# Altium schematic sheet MSXIV_ConnectorTestingBoard.SchDoc: Connector Testing Board
size Letter; Author: Ricky Huang; Website: www.uwmidsun.com
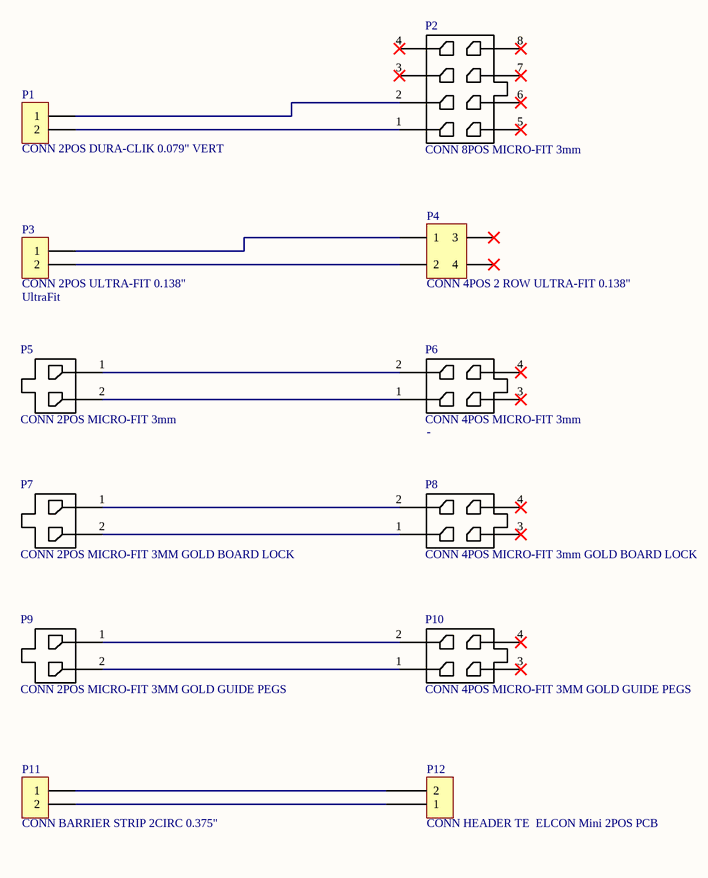
[diagram p0: MSXIV_ConnectorTestingBoard.SchDoc]

## Parts
P1  CONN 2POS DURA-CLIK 0.079" VERT  [CONN, 2POS Dura-Click Vertical]
P2  CONN 8POS MICRO-FIT 3mm  [CONN, 8POS MICRO-FIT]
P3  CONN 2POS ULTRA-FIT 0.138"  Series: UltraFit  [CONN, 2POS ULTRA-FIT]
P4  CONN 4POS 2 ROW ULTRA-FIT 0.138"  [CONN, 4POS 2 ROW ULTRA-FIT]
P5  CONN 2POS MICRO-FIT 3mm  [CONN 2POS MICRO-FIT 3mm-Footprint-1]
P6  CONN 4POS MICRO-FIT 3mm  [CONN 4POS MICROFIT (2x2)]
P7  CONN 2POS MICRO-FIT 3MM GOLD BOARD LOCK  [CONN HEADER VERT 2POS 3MM GOLD BOARD LOCK-Footprint-1]
P8  CONN 4POS MICRO-FIT 3mm GOLD BOARD LOCK  [CONN 4POS MICRO-FIT 3mm GOLD BOARD LOCK-Footprint-1]
P9  CONN 2POS MICRO-FIT 3MM GOLD GUIDE PEGS  [CONN 2POS MICRO-FIT 3MM GOLD GUIDE PEGS-Footprint-1]
P10  CONN 4POS MICRO-FIT 3MM GOLD GUIDE PEGS  [CONN 4POS MICRO-FIT 3MM GOLD GUIDE PEGS-Footprint-1]
P11  CONN BARRIER STRIP 2CIRC 0.375"  [TE_3-1437652-9]
P12  CONN HEADER TE  ELCON Mini 2POS PCB  [CONN HEADER TE  ELCON Mini 2POS PCB-Footprint-1]

## Nets
NetP1_1: P1.1 P2.2
NetP1_2: P1.2 P2.1
NetP3_1: P3.1 P4.1
NetP3_2: P3.2 P4.2
NetP5_1: P5.1 P6.2
NetP5_2: P5.2 P6.1
NetP7_1: P7.1 P8.2
NetP7_2: P7.2 P8.1
NetP9_1: P9.1 P10.2
NetP9_2: P9.2 P10.1
NetP11_1: P11.1 P12.2
NetP11_2: P11.2 P12.1

Not connected (* = marked no-connect by the designer): P2 3* 4* 5* 6* 7* 8*; P4 3* 4*; P6 3* 4*; P8 3* 4*; P10 3* 4*

## Notes on the sheet
- Project:
- Title:
- Size:
- Project Author
- Letter
- Revision:
- University of Waterloo
- 200 University Ave W
- Waterloo, ON, Canada
- N2L 3E9
- Date:
- Sheet
- of
- Website:

## Library data of the parts
P1 = CMP-007-0025-1: 2 Positions Header, Shrouded Connector 0.079" (2.00mm) Surface Mount, Vertical Tin; Manufacturer: Molex, LLC; Manufacturer Part Number: 5600200220; Number of Positions: 2; Shrouding: Shrouded - 4 Wall; Mated Stacking Heights: 9.3mm; Number of Positions Loaded: All; Style: Board to Cable/Wire; Overall Contact Length: -; Contact Length - Post: -; Contact Shape: Square; Material Flammability Rating: -; Stock 1: 11912; Row Spacing - Mating: -; Number of Rows: 1; Insulation Height: 0.315" (8.00mm); Operating Temperature: -; Part Status: Active; Pitch - Mating: 0.079" (2.00mm); Insulation Material: Polyamide (PA), Nylon; ComponentLink1URL: http://www.molex.com/pdm_docs/sd/5600200220_sd.pdf; Contact Length - Mating: -; Ingress Protection: -; ComponentLink1Description: http://www.molex.com/pdm_docs/sd/5600200220_sd.pdf; Contact Finish - Mating: Tin; Design Item ID: CONN 2POS DURA-CLIK 0.079" VERT; Insulation Color: Natural; Current Rating: -; Packaging: Cut Tape (CT); Pricing 1: 1=1.16, 10=1.012, 25=0.952, 50=0.9122, 100=0.8727, 250=0.79336 (CAD); Connector Type: Header; Fastening Type: Latch Lock; Contact Finish Thickness - Mating: -; Termination: Solder; Features: Solder Retention; Contact Material: Copper Alloy; Contact Finish - Post: Tin; Contact Type: Male Pin; Voltage Rating: -; Contact Finish Thickness - Post: -; Source: Schematic Diagrams.SchLib; Applications: Automotive, Industrial; RoHS: RoHS Compliant; Mounting Type: Surface Mount
P2 = CMP-007-0004-1: Connector Header Through Hole 6 position 0.118" (3.00mm); Manufacturer Part Number: 0430450827; Manufacturer: Molex, LLC; Style: Board to Cable/Wire; Material Flammability Rating: UL94 V-0; Number of Positions Loaded: All; Shrouding: Shrouded - 4 Wall; Contact Length - Post: 0.125" (3.18mm); Number of Positions: 6; Mounting Type: Through Hole; ComponentLink2Description: https://www.molex.com/pdm_docs/sd/430450827_sd.pdf; Source: Schematic Diagrams.SchLib; Packaging: Tray; Stock 1: 5553; Fastening Type: Locking Ramp; Applications: General Purpose, Medical, Military, Telecommunications; Ingress Protection: -; Design Item ID: CONN 8POS MICRO-FIT 3mm; RoHS: RoHS Compliant; ComponentLink1URL: https://www.molex.com/pdm_docs/sd/430450627_sd.pdf; Insulation Color: Black; Voltage Rating: -; Contact Finish - Mating: Tin; Pricing 1: 1=2.69, 10=2.445, 25=2.2964, 50=2.1964, 100=2.0965, 250=1.8968, 500=1.74704, 1440=1.49746, 2880=1.39763 (CAD); ComponentLink2URL: https://www.molex.com/pdm_docs/sd/430450827_sd.pdf; Contact Finish - Post: Tin; Termination: Solder; Pitch - Mating: 0.118" (3.00mm); Row Spacing - Mating: 0.118" (3.00mm); ComponentLink1Description: https://www.molex.com/pdm_docs/sd/430450627_sd.pdf; Part Status: Active; Contact Shape: Square; Contact Length - Mating: -; Insulation Height: 0.390" (9.91mm); Insulation Material: Liquid Crystal Polymer (LCP), Glass Filled; Contact Material: Brass; Contact Finish Thickness - Mating: 60.0µin (1.52µm); Mated Stacking Heights: -; Current Rating: -; Contact Type: Male Pin; Contact Finish Thickness - Post: -; Overall Contact Length: -; Number of Rows: 2; Features: Board Guide; Operating Temperature: -; Connector Type: Header
P3 = CMP-007-0011-1: 2 Positions Header, Shrouded Connector 0.138" (3.50mm) Through Hole Gold; Manufacturer 1: Molex, LLC; Manufacturer Part Number 1: 1722861302; Style: Board to Board or Cable; Number of Positions: 2; Number of Positions Loaded: All; Shrouding: Shrouded - 4 Wall; Mated Stacking Heights: 26.99mm; Material Flammability Rating: UL94 V-0; Voltage: 400V; Contact Length - Post: 0.126" (3.20mm); Source: Schematic Diagrams.SchLib; Contact Type: Male Pin; Insulation Material: Liquid Crystal Polymer (LCP); Insulation Color: Black; Part Status: Active; Termination: Kinked Pin, Solder; Number of Rows: 1; Pitch - Mating: 0.138" (3.50mm); Fastening Type: Latch Holder; Row Spacing - Mating: -; Connector Type: Header; Contact Material: Copper Alloy; Contact Shape: Square; Contact Finish Thickness - Mating: 30µin (0.76µm); Contact Finish - Post: Tin; Contact Length - Mating: -; Contact Finish Thickness - Post: 60µin (1.52µm); Contact Finish - Mating: Gold; Operating Temperature: -40°C ~ 120°C; Ingress Protection: -; Design Item ID: CONN 2POS ULTRA-FIT 0.138"; Overall Contact Length: -; Current Rating: -; Mounting Type: Through Hole; Insulation Height: 0.465" (11.80mm); ComponentLink1URL: http://www.molex.com/pdm_docs/sd/1722861302_sd.pdf; ComponentLink1Description: http://www.molex.com/pdm_docs/sd/1722861302_sd.pdf; Packaging: Tray
P4 = CMP-007-0027-2: Connector Header Through Hole 4 position 0.138" (3.50mm); Manufacturer Part Number 1: 1722991104; Manufacturer 1: Molex; Number of Positions: 4; Pitch: 0.138inch; Description 1: ULTRA-FIT HDR VT DUAL F BLK 04CKT TIN; Row Spacing: 0.181inch; Connector Type: Male Pin; Stock 1: 958; ComponentLink1URL: http://www.literature.molex.com/SQLImages/kelmscott/Molex/PDF_Images/987651-1008.pdf; Source: Schematic Diagrams.SchLib; Design Item ID: CONN 4POS 2 ROW ULTRA-FIT 0.138"; Packaging: Tray; Colour: Black; Fastening Type: Latch; Number of Rows: 2; Contact Plating: Tin; Termination: Solder; ComponentLink1Description: http://www.literature.molex.com/SQLImages/kelmscott/Molex/PDF_Images/987651-1008.pdf; Pricing 1: 1=0.86, 10=0.753, 100=0.6494, 500=0.53136, 1000=0.47232, 5000=0.41328, 10000=0.39262 (USD); Mount: Through Hole
P5 = CMP-002-00074-8: Conn Power HDR 2 POS 3mm Solder ST Thru-Hole 2 Terminal 1 Port Tray; Glow Wire Compliant: Compliant; Current Rating: 5A; Number of Positions: 2; Max Voltage Rating (AC): 250V; Connector Type: Male Pin; Max Voltage Rating (DC): 250.25kV; Gender: Male; Contact Resistance: 10mR; Voltage Rating: 600V; Contact Material: Brass,Tin; Height: 9.9mm; Max Operating Temperature: 105°C; Mount: Through Hole; Lead Free: Lead Free; Min Operating Temperature: -40°C; Flammability Rating: UL94 V-0; Housing Material: Thermoplastic; Number of Circuits: 2; Number of Contacts: 2; Halogen Free: Low Halogen; Packaging: Tray; Max Current Rating: 5A; Radiation Hardening: No; Pitch: 3mm; Voltage Rating (DC): 250V; Orientation: Vertical; Depth: 4.57mm; Number of Rows: 1; Contact Plating: Tin; Housing Color: Black; REACH SVHC: Unknown; Length: 9.65mm; Pins: 2; Termination: Solder; Package Quantity: 3264
P6 = CMP-003-0105-1: Micro-Fit 3.0 Vertical Header, 3.00mm Pitch, Dual Row, 4 Circuits, with PCB Polarizing Peg, Tin, Glow-Wire Capable, Black; Manufacturer: Molex, LLC; Manufacturer Part Number: 430450427; Contact Resistance: 10mR; Number of Positions: 6; Number of Positions Loaded: All; Number of Ports: 1; Shrouding: Shrouded - 4 Wall; Number of Contacts: 4; Pitch - Mating: 0.118" (3.00mm); Row Spacing: 0.118inch; Style: Board to Cable/Wire; Material Flammability Rating: UL94 V-0; Contact Length - Post: 0.125" (3.18mm); Source: Schematic Diagrams.SchLib; ComponentLink1URL: http://www.molex.com/webdocs/datasheets/pdf/en-us/0430450427_PCB_HEADERS.pdf; Current Rating: -; Contact Material: Brass; Contact Plating: Tin; Features: Board Guide; Applications: General Purpose, Medical, Military, Telecommunications; Pitch: 3mm; Contact Finish Thickness - Post: -; Max Operating Temperature: 105°C; Insulation Height: 0.390" (9.91mm); Depth: 8.77mm; Contact Shape: Square; Design Item ID: CONN 4POS MICRO-FIT 3mm; Contact Finish Thickness - Mating: 60.0µin (1.52µm); Contact Length - Mating: -; Color: Black; Overall Contact Length: -; Number of Terminals: 4; Length: 10.15mm; RoHS: RoHS Compliant; Ingress Protection: -; Insulation Color: Black; Operating Temperature: -; Connector Type: Header; Housing Color: Black; Contact Finish - Mating: Tin; Row Spacing - Mating: 0.118" (3.00mm); ComponentLink1Description: http://www.molex.com/webdocs/datasheets/pdf/en-us/0430450427_PCB_HEADERS.pdf; Mount: Through Hole; Orientation: Straight; Part Status: Active; Contact Finish - Post: Tin; Housing Material: Polymer; Voltage Rating: -; Termination: Solder; Contact Type: Male Pin; Mated Stacking Heights: -; Package Quantity: 2232; Min Operating Temperature: -40°C; Fastening Type: Locking Ramp; Insulation Material: Liquid Crystal Polymer (LCP), Glass Filled; Packaging: Tray; Number of Rows: 2; Mounting Type: Through Hole
P7 = CMP-002-00072-6: Conn Power HDR 2 POS 3mm Solder ST Thru-Hole 2 Terminal 1 Port Micro-Fit 3.0™ Tray; Connector Type: Male Pin; Number of Contacts: 2; Number of Ports: 1; Termination: Solder; Orientation: Straight; Number of Rows: 1; Housing Material: Thermoplastic; Max Operating Temperature: 105°C; Packaging: Tray; Color: Black; Mount: Through Hole; Number of Terminals: 2; Pitch: 3mm; Contact Material: Brass; Fastening Type: Ramp; Contact Plating: Gold,GXT; Length: 9.65mm; Depth: 5.57mm; Number of Positions: 2; Min Operating Temperature: -40°C; Package Quantity: 3264
P8 = CMP-002-00073-4: CONN HEADER VERT 4POS 3MM; Contact Resistance: 10mR; Number of Ports: 1; Row Spacing: 0.118inch; Number of Positions: 4; Connector Type: Male Pin; Color: Black; Depth: 8.77mm; Housing Material: Polymer; Lead Free: Lead Free; Max Operating Temperature: 105°C; Fastening Type: Latch; Number of Rows: 2; Orientation: Straight; Contact Material: Brass; Housing Color: Black; Number of Terminals: 4; Mount: Through Hole; Pitch: 3mm; Contact Plating: Gold; Packaging: Tray; Min Operating Temperature: -40°C; Number of Contacts: 4; Termination: Solder; Length: 10.15mm
P9 = CMP-002-00075-6: Conn; Rect; Header; 2 Cir; PCB; MicroFit 3.0; Vertical; Single; SMT; w/Peg; Gold; Number of Ports: 1; Connector Type: Male Pin; Number of Positions: 2; Max Voltage Rating (AC): 250V; Pitch: 3mm; Fastening Type: Ramp; Contact Material: Brass; Number of Contacts: 2; Number of Terminals: 2; Mount: Through Hole; Depth: 5.57mm; Max Operating Temperature: 105°C; Min Operating Temperature: -40°C; Housing Material: Polymer; Orientation: Straight; Contact Plating: Gold; Termination: Solder; Color: Black; Length: 9.65mm; Packaging: Tray; Number of Rows: 1
P10 = CMP-002-00076-4: Conn Power HDR 4 POS 3mm Solder ST Thru-Hole 4 Terminal 1 Port Micro-Fit 3.0™ Tray; Number of Contacts: 4; Row Spacing: 0.118inch; Max Voltage Rating (AC): 250V; Number of Ports: 1; Contact Resistance: 10mR; Connector Type: Male Pin; Number of Rows: 2; Number of Terminals: 4; Color: Black; Fastening Type: Ramp; Number of Positions: 4; Pitch: 3mm; Termination: Solder; Housing Material: Polymer; Packaging: Tray; Contact Material: Brass; Min Operating Temperature: -40°C; Housing Color: Black; Length: 10.15mm; Contact Plating: Gold; Depth: 8.77mm; Orientation: Straight; Max Operating Temperature: 105°C; Mount: Through Hole
P11 = CMP-007-0031-3: Conn Power HDR 5 POS 3mm Solder ST Thru-Hole 5 Terminal 1 Port Micro-Fit 3.0™ Tray; Manufacturer: TE Connectivity; Manufacturer Part Number: 6PCV-02-006; Mounting Ears: No (Without); Number of Circuits: 2; Wire Gauge (Max): 12AWG; Wire/Cable Gauge: 22AWG; Contact Resistance: 30mR; Pitch: 9.53mm; Max Current Rating: 25A; Current Rating: 5A; Voltage Rating: 300V; Connector Type: Male Pin; Number of Levels: 1; Max Voltage Rating (AC): 250V; Max Operating Temperature: 105°C; Height: 0.625inch; ELV: Compliant; Number of Rows: 1; ComponentLink1URL: https://datasheet.ciiva.com/7978/1650932-7978603.pdf?src-supplier=Element14; Orientation: Straight; REACH SVHC: Unknown; Mounting Insert: No (Without); ComponentLink1Description: https://datasheet.ciiva.com/7978/1650932-7978603.pdf?src-supplier=Element14; Flammability Rating: UL94 V-0; Packaging: Bulk; Housing Material: Thermoplastic; Number of Contacts: 2; Case/Package: 270; Stock 2: 6059; Wire Gauge (Min): 22AWG; Design Item ID: CONN BARRIER STRIP 2CIRC 0.375"; Color: Black; Source: Schematic Diagrams.SchLib; Stock 1: 8088; Number of Positions: 2; Mount: Through Hole; Contact Plating: Tin; RoHS: Yes; Length: 0.811inch; Housing Color: Black; Depth: 5.57mm; Terminal Material: Copper Alloy; Voltage: 300V; Min Operating Temperature: -40°C; Number of Ports: 1; Pricing 1: 1=1.63000, 10=1.14400, 25=1.06680, 50=0.96820, 100=0.96400, 250=0.81404, 500=0.77122, 1000=0.68552, 5000=0.55699 (USD); Pricing 2: 1=1.14000, 10=0.99900, 100=0.86150, 500=0.70488, 1000=0.62656, 5000=0.54824, 10000=0.52083 (USD); Contact Material: Copper Alloy; Number of Terminals: 5; Fastening Type: Ramp; Termination: Solder; Width: 0.7inch
P12 = CMP-002-00071-4: CONN HEADER 2POS PCB; Number of Power Positions: 2; PCB Mounting Orientation: Vertical; Connector System: Wire-to-Board; Current Rating: 45A; Number of Ports: 1; Connector Type: Pin; Pitch: 7.8mm; Gender: Male; Sealable: No (Without); Contact Retention: Yes (With); Circuit Application: Power; Contact Current Rating: 40A; Contact Material: Copper Alloy,Copper; Package Quantity: 150; Depth: 10.2mm; Number of Rows: 1; Orientation: Straight; Packaging: Tape and Reel; Length: 18.9mm; Housing Material: Polymer; Housing Color: Black; REACH SVHC: Unknown; Radiation Hardening: No; Max Operating Temperature: 125°C; Termination: Through Hole; Number of Terminals: 4; Contact Plating: Silver; Flammability Rating: UL94 V-0; Number of Contacts: 2; Min Operating Temperature: -40°C; Number of Positions: 2; Contact Gender: Male; Row Spacing: 7.8mm; Mount: Through Hole